# Altium project Experiment3.PrjPcb
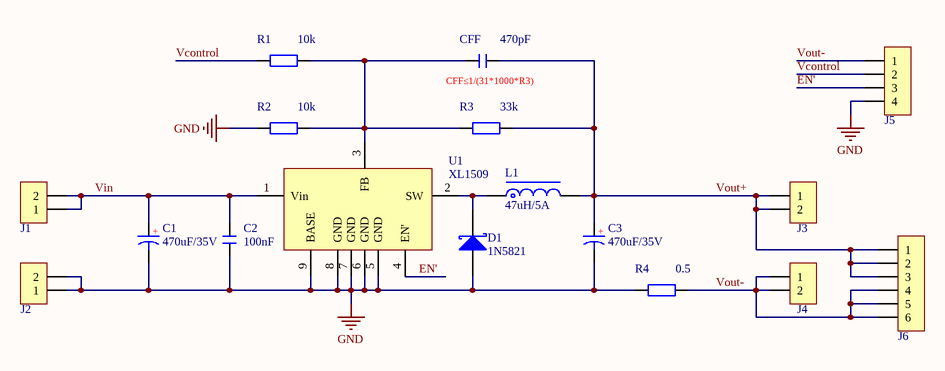
[diagram p0: Sheet1.SchDoc]
1 sheet, 17 parts. Net scope: global (net labels, ports and power ports of the same name join across sheets).
Board file: PCB1.PcbDoc

## Sheet Sheet1.SchDoc
size A4; SheetNumber: 1; SheetTotal: 1

### Parts
C1  470uF/35V  [CS 10*8 - B]
C2  100nF  [C0603_L]
C3  470uF/35V  [CS 10*8 - B]
CFF  470pF  [C0603_L]
D1  1N5821  [DO41]
J1  HDR-1X2  [HDR2.54-LI-2P]  (value not drawn)
J2  HDR-1X2  [HDR2.54-LI-2P]  (value not drawn)
J3  HDR-1X2  [HDR2.54-LI-2P]  (value not drawn)
J4  HDR-1X2  [HDR2.54-LI-2P]  (value not drawn)
J5  HDR-1X4  [HDR2.54-LI-4P]  (value not drawn)
J6  HDR-1X6  [HDR2.54-M-LI-6P]  (value not drawn)
L1  47uH/5A  [LMR135]
R1  10k  [R0603_L]
R2  10k  [R0603_L]
R3  33k  [R0603_L]
R4  0.5  [R1206_L]
U1  XL1509  [ESOP8_M]

### Nets
GND: C1.2 C2.2 C3.2 D1.1(A) J2.1 J2.2 J5.4 R2.1 R4.1 U1.5(GND) U1.6(GND) U1.7(GND) U1.8(GND) U1.9(BASE)
EN': J5.3 U1.4(EN')
Vcontrol: J5.2 R1.1
Vin: C1.1 C2.1 J1.1 J1.2 U1.1(Vin)
Vout+: C3.1 CFF.2 J3.1 J3.2 J6.1 J6.2 J6.3 L1.2 R3.2
Vout-: J4.1 J4.2 J5.1 J6.4 J6.5 J6.6 R4.2
NetCFF_1: CFF.1 R1.2 R2.2 R3.1 U1.3(FB)
NetD1_2: D1.2(K) L1.1 U1.2(SW)

### Notes on the sheet
- (near CFF) CFF≤1/(31*1000*R3)
- (in symbol CS_SMD) +

### Library data of the parts
C1 C3 = CS_SMD: 贴片固态电容; 版权归属: 封装库来自淘宝 ID：黄晶宝石; BOM名称: 贴片固态电容; 联系售后: https://item.taobao.com/item.htm?id=566775463719
C2 CFF = C: 贴片电容; BOM名称: 无极性贴片电容; 淘宝ID: 封装库来自淘宝 ID：黄晶宝石; 联系售后，技术支持: https://shop463601444.taobao.com; 唯一出售店铺网址: https://shop463601444.taobao.com
J1-J4 = Header 2: 2P接插件; 版权归属: 封装库来自淘宝 ID：黄晶宝石; BOM名称: 2P接插件
J5 = Header 4: 4P接插件; 版权归属: 封装库来自淘宝 ID：黄晶宝石; 学习资源: 最新版本发布https://item.taobao.com/item.htm?id=566775463719; BOM名称: 4P接插件
J6 = Header 6: 6P接插件; 学习资源: 最新版本发布https://item.taobao.com/item.htm?id=566775463719; 版权归属: 封装库来自淘宝 ID：黄晶宝石; BOM名称: 6P接插件
L1 = L-MR: 功率磁环电感; 淘宝ID: 封装库来自淘宝 ID：黄晶宝石; BOM名称: 功率磁环电感; 联系售后: https://item.taobao.com/item.htm?id=566775463719
R1-R4 = R: 贴片电阻; 版权归属: 来自淘宝 ID：黄晶宝石; 封装库来自淘宝卖家 ID：黄晶宝石: 其他店铺购入均为盗版，不享受售后技术支持服务，请立即申请退款; BOM名称: 贴片电阻; 联系售后: https://item.taobao.com/item.htm?id=566775463719